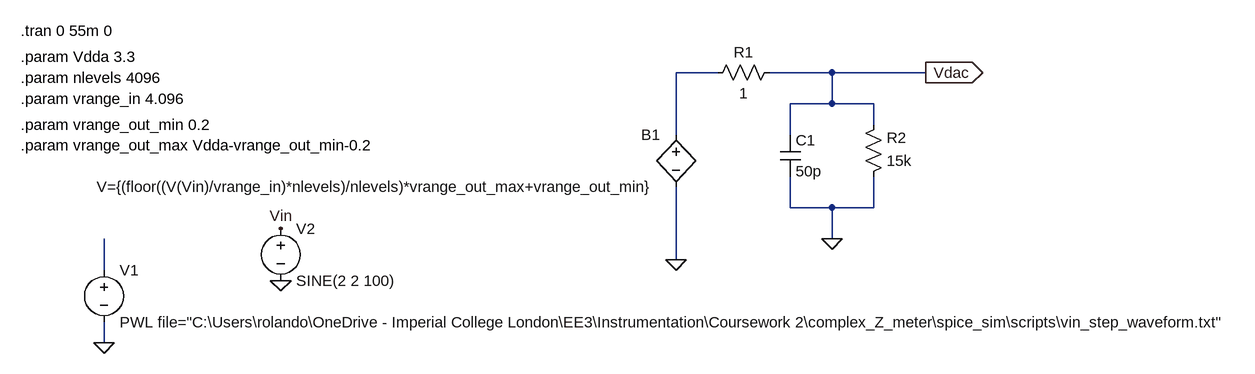
[diagram p0: schematic DAC.asc]
DAC.asc, the LTspice schematic file:
Version 4
SHEET 1 1824 680
WIRE 272 0 208 0
WIRE 448 0 352 0
WIRE 592 0 448 0
WIRE 448 48 448 0
WIRE 448 48 384 48
WIRE 512 48 448 48
WIRE 512 80 512 48
WIRE 208 96 208 0
WIRE 384 96 384 48
WIRE 384 208 384 160
WIRE 448 208 384 208
WIRE 512 208 512 160
WIRE 512 208 448 208
WIRE 448 256 448 208
WIRE 208 288 208 176
WIRE -672 304 -672 256
WIRE -672 416 -672 384
FLAG 592 0 Vdac
IOPIN 592 0 Out
FLAG 448 256 0
FLAG 208 288 0
FLAG -400 240 Vin
FLAG -672 416 0
FLAG -400 320 0
SYMBOL bv 208 80 M0
SYMATTR InstName B1
SYMATTR Value V={(floor((V(Vin)/vrange_in)*nlevels)/nlevels)*vrange_out_max+vrange_out_min}
SYMBOL cap 368 96 R0
SYMATTR InstName C1
SYMATTR Value 50p
SYMBOL res 496 176 M180
WINDOW 0 36 76 Left 2
WINDOW 3 36 40 Left 2
SYMATTR InstName R2
SYMATTR Value 15k
SYMBOL voltage -672 288 R0
WINDOW 123 0 0 Left 0
WINDOW 39 0 0 Left 0
SYMATTR InstName V1
SYMATTR Value PWL file="C:\Users\rolando\OneDrive - Imperial College London\EE3\Instrumentation\Coursework 2\complex_Z_meter\spice_sim\scripts\vin_step_waveform.txt"
SYMBOL res 368 -16 R90
WINDOW 0 0 56 VBottom 2
WINDOW 3 32 56 VTop 2
SYMATTR InstName R1
SYMATTR Value 1
SYMBOL voltage -400 224 R0
WINDOW 123 0 0 Left 0
WINDOW 39 0 0 Left 0
SYMATTR InstName V2
SYMATTR Value SINE(2 2 100)
TEXT -800 8 Left 2 !.param nlevels 4096
TEXT -800 40 Left 2 !.param vrange_in 4.096
TEXT -800 -64 Left 2 !.tran 0 55m 0
TEXT -800 112 Left 2 !.param vrange_out_max Vdda-vrange_out_min-0.2
TEXT -800 80 Left 2 !.param vrange_out_min 0.2
TEXT -800 -24 Left 2 !.param Vdda 3.3

The netlist it stands for:
* DAC.asc
B1 N001 0 V={(floor((V(Vin)/vrange_in)*nlevels)/nlevels)*vrange_out_max+vrange_out_min}
C1 Vdac 0 50p
R2 0 Vdac 15k
V1 N002 0 PWL file="C:\Users\rolando\OneDrive - Imperial College London\EE3\Instrumentation\Coursework 2\complex_Z_meter\spice_sim\scripts\vin_step_waveform.txt"
R1 Vdac N001 1
V2 Vin 0 SINE(2 2 100)
.param nlevels 4096
.param vrange_in 4.096
.tran 0 55m 0
.param vrange_out_max Vdda-vrange_out_min-0.2
.param vrange_out_min 0.2
.param Vdda 3.3
.backanno
.end

* Results of the author's LTspice run, read from the files saved beside the schematic
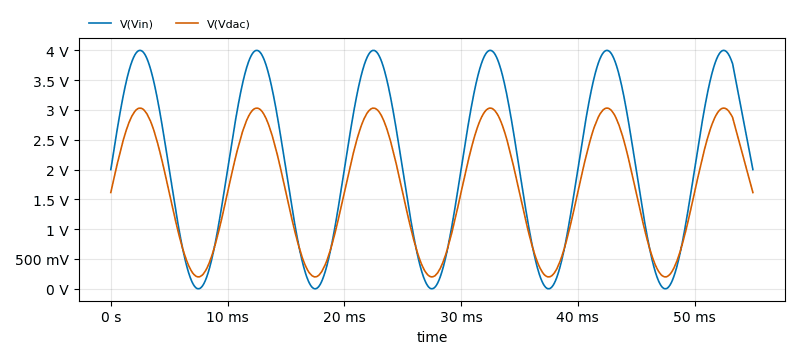
[diagram p1: Transient Analysis of DAC.asc, plotted from the saved traces]
* Transient Analysis, 1 run:
*   V(Vin): min 0 V, max 4 V, average 2.115 V, rms 2.542 V, last 2 V
*   V(Vdac): min 200 mV, max 3.032 V, average 1.697 V, rms 1.969 V, last 1.615 V